# Altium schematic sheet STC11F02_SOP20_TDisplay.SchDoc
size A4; Organization: Altium Limited; Address1: L3, 12a Rodborough Rd; Address2: Frenchs Forest; Address3: NSW; Address4: Australia 2086
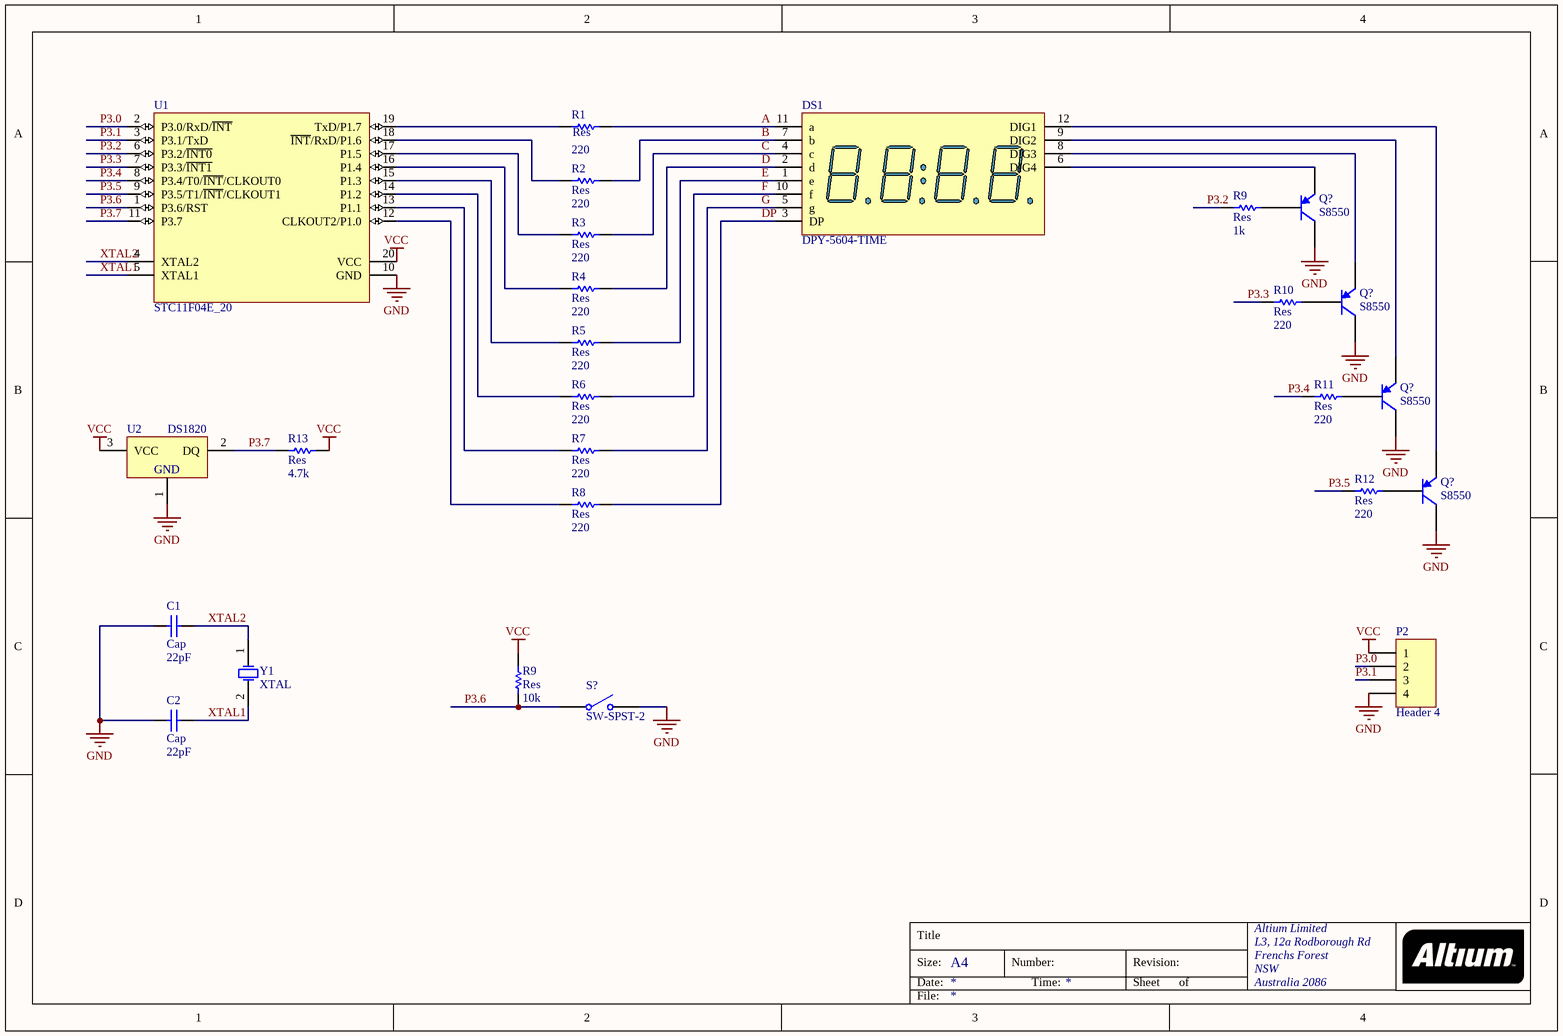
[diagram p0: STC11F02_SOP20_TDisplay.SchDoc]

## Parts
(Parts that share a designator on the sheet are numbered #1, #2 ... from top to bottom, then left to right.)
C1  Cap  value 22pF  [C0805]
C2  Cap  value 22pF  [C0805]
DS1  DPY-5604-TIME  [DPY-5604]
P2  Header 4  [HDR1X4]
Q?#1  S8550  [SOT-23]
Q?#2  S8550  [SOT-23]
Q?#3  S8550  [SOT-23]
Q?#4  S8550  [SOT-23]
R1  Res  value 220  [0805]
R2  Res  value 220  [0805]
R3  Res  value 220  [0805]
R4  Res  value 220  [0805]
R5  Res  value 220  [0805]
R6  Res  value 220  [0805]
R7  Res  value 220  [0805]
R8  Res  value 220  [0805]
R9#1  Res  value 1k  [0805]
R9#2  Res  value 10k  [0805]
R10  Res  value 220  [0805]
R11  Res  value 220  [0805]
R12  Res  value 220  [0805]
R13  Res  value 4.7k  [0805]
S?  SW-SPST-2  [SW-SPST-2(6*3.5)]
U1  STC11F04E_20  [DIP20]
U2  DS1820  [TO-92]
Y1  XTAL  [XTAL1]

## Nets
GND: C1.2 C2.2 P2.4 Q?#1.3(C) Q?#2.3(C) Q?#3.3(C) Q?#4.3(C) S?.2(NO) U1.10(GND) U2.1(GND)
VCC: P2.1 R9#2.2 R13.2 U1.20(VCC) U2.3(VCC)
A: DS1.11(a) R1.2
B: DS1.7(b) R2.2
C: DS1.4(c) R3.2
D: DS1.2(d) R4.2
DP: DS1.3(DP) R8.2
E: DS1.1(e) R5.2
F: DS1.10(f) R6.2
G: DS1.5(g) R7.2
P3.0: P2.2 U1.2(P3.0/RxD/~{INT})
P3.1: P2.3 U1.3(P3.1/TxD)
P3.2: R9#1.1 U1.6(P3.2/~{INT0})
P3.3: R10.1 U1.7(P3.3/~{INT1})
P3.4: R11.1 U1.8(P3.4/T0/~{INT}/CLKOUT0)
P3.5: R12.1 U1.9(P3.5/T1/~{INT}/CLKOUT1)
P3.6: R9#2.1 S?.1(COMMON) U1.1(P3.6/RST)
P3.7: R13.1 U1.11(P3.7) U2.2(DQ)
XTAL1: C2.1 U1.5(XTAL1) Y1.2(OSC2)
XTAL2: C1.1 U1.4(XTAL2) Y1.1(OSC1)
NetDS1_6: DS1.6(DIG4) Q?#1.1(E)
NetDS1_8: DS1.8(DIG3) Q?#2.1(E)
NetDS1_9: DS1.9(DIG2) Q?#3.1(E)
NetDS1_12: DS1.12(DIG1) Q?#4.1(E)
NetQ?#1_2: Q?#1.2(B) R9#1.2
NetQ?#2_2: Q?#2.2(B) R10.2
NetQ?#3_2: Q?#3.2(B) R11.2
NetQ?#4_2: Q?#4.2(B) R12.2
NetR1_1: R1.1 U1.19(TxD/P1.7)
NetR2_1: R2.1 U1.18(~{INT}/RxD/P1.6)
NetR3_1: R3.1 U1.17(P1.5)
NetR4_1: R4.1 U1.16(P1.4)
NetR5_1: R5.1 U1.15(P1.3)
NetR6_1: R6.1 U1.14(P1.2)
NetR7_1: R7.1 U1.13(P1.1)
NetR8_1: R8.1 U1.12(CLKOUT2/P1.0)

## Notes on the sheet
- Title
- Size:
- Date:
- A4
- Number:
- Time:
- Revision:
- Sheet
- of
- File:

## Library data of the parts
C1 C2 = Cap: Capacitor; Published: 8-Jun-2000; LatestRevisionDate: 17-Jul-2002; LatestRevisionNote: Re-released for DXP Platform.; PackageReference: RAD-0.3; Publisher: Altium Limited; PackageDescription: Radial Cap, Thru-Hole; 2 Leads; 0.3 in Pin Spacing
DS1 = DPY-5604-TIME: 0.56英寸4位时间格式数码管; MinimumIntensity: 2020 ucd; Note: IF = 10 mA; Colour: Blue; Published: 8-Jun-2000; LatestRevisionDate: 17-Dec-2003; LatestRevisionNote: Schematic revised, PCB Footprint replaced.; DatasheetDocument: 24-Sep-2002; PackageDocument: 24-Sep-2002; PackageReference: H; Publisher: Altium Limited; ComponentLink1Description: Manufacturer Link; ComponentLink1URL: http://www.agilent.com/
P2 = Header 4: Header, 4-Pin; LatestRevisionDate: 17-Jul-2002; LatestRevisionNote: Re-released for DXP Platform.; Publisher: Altium Limited
Q?#1-Q?#4 = S8550: PNP 三极管
R1-R8 R9#1 R9#2 R10-R13 = Res: Resistor; Published: 8-Jun-2000; LatestRevisionDate: 17-Jul-2002; LatestRevisionNote: Re-released for DXP Platform.; PackageReference: AXIAL-0.3; Publisher: Altium Limited; PackageDescription: Axial Device, Thru-Hole; 2 Leads; 0.3 in Pin Spacing
S? = SW-SPST-2: 单刀单掷开关
U1 = STC11F04E_20: 增强型8051单片机
U2 = DS1820: 1-Wire 数字温度计; ComponentAvailability: Obsolete; Published: 13-Oct-2000; LatestRevisionDate: 17-Jul-2002; LatestRevisionNote: Re-released for DXP Platform.; DatasheetVersion: 5-Mar-1998; PackageVersion: 1999; PackageReference: PR35; Publisher: Altium Limited; PackageDescription: TO, Flat Index; 3 In-Line, Axial Leads; Body Dia. 4.6mm; Leads 0.56 x 0.51 mm (max); ComponentLink1Description: Manufacturer Link; ComponentLink1URL: http://www.maxim-ic.com/; ComponentLink2Description: Datasheet; ComponentLink2URL: http://pdfserv.maxim-ic.com/en/ds/DS1820-DS1820S.pdf; ComponentLink3Description: Discontinuation Notice; ComponentLink3URL: http://www.maxim-ic.com/qa/pdfs/non-obsolescence-letter.pdf
Y1 = XTAL: Crystal Oscillator; Published: 8-Jun-2000; LatestRevisionDate: 17-Jul-2002; LatestRevisionNote: Re-released for DXP Platform.; PackageReference: R38; Publisher: Altium Limited; PackageDescription: Crystal, Thru-Hole; 2 Leads; Body 3.1 x 8.2 mm (Dia.xH)